# Altium schematic sheet AIM2 - External Interfaces REVB.SchDoc: External Interfaces
size B; DrawnBy: DJW; DocumentNumber: 7; SheetNumber: 7; SheetTotal: 12
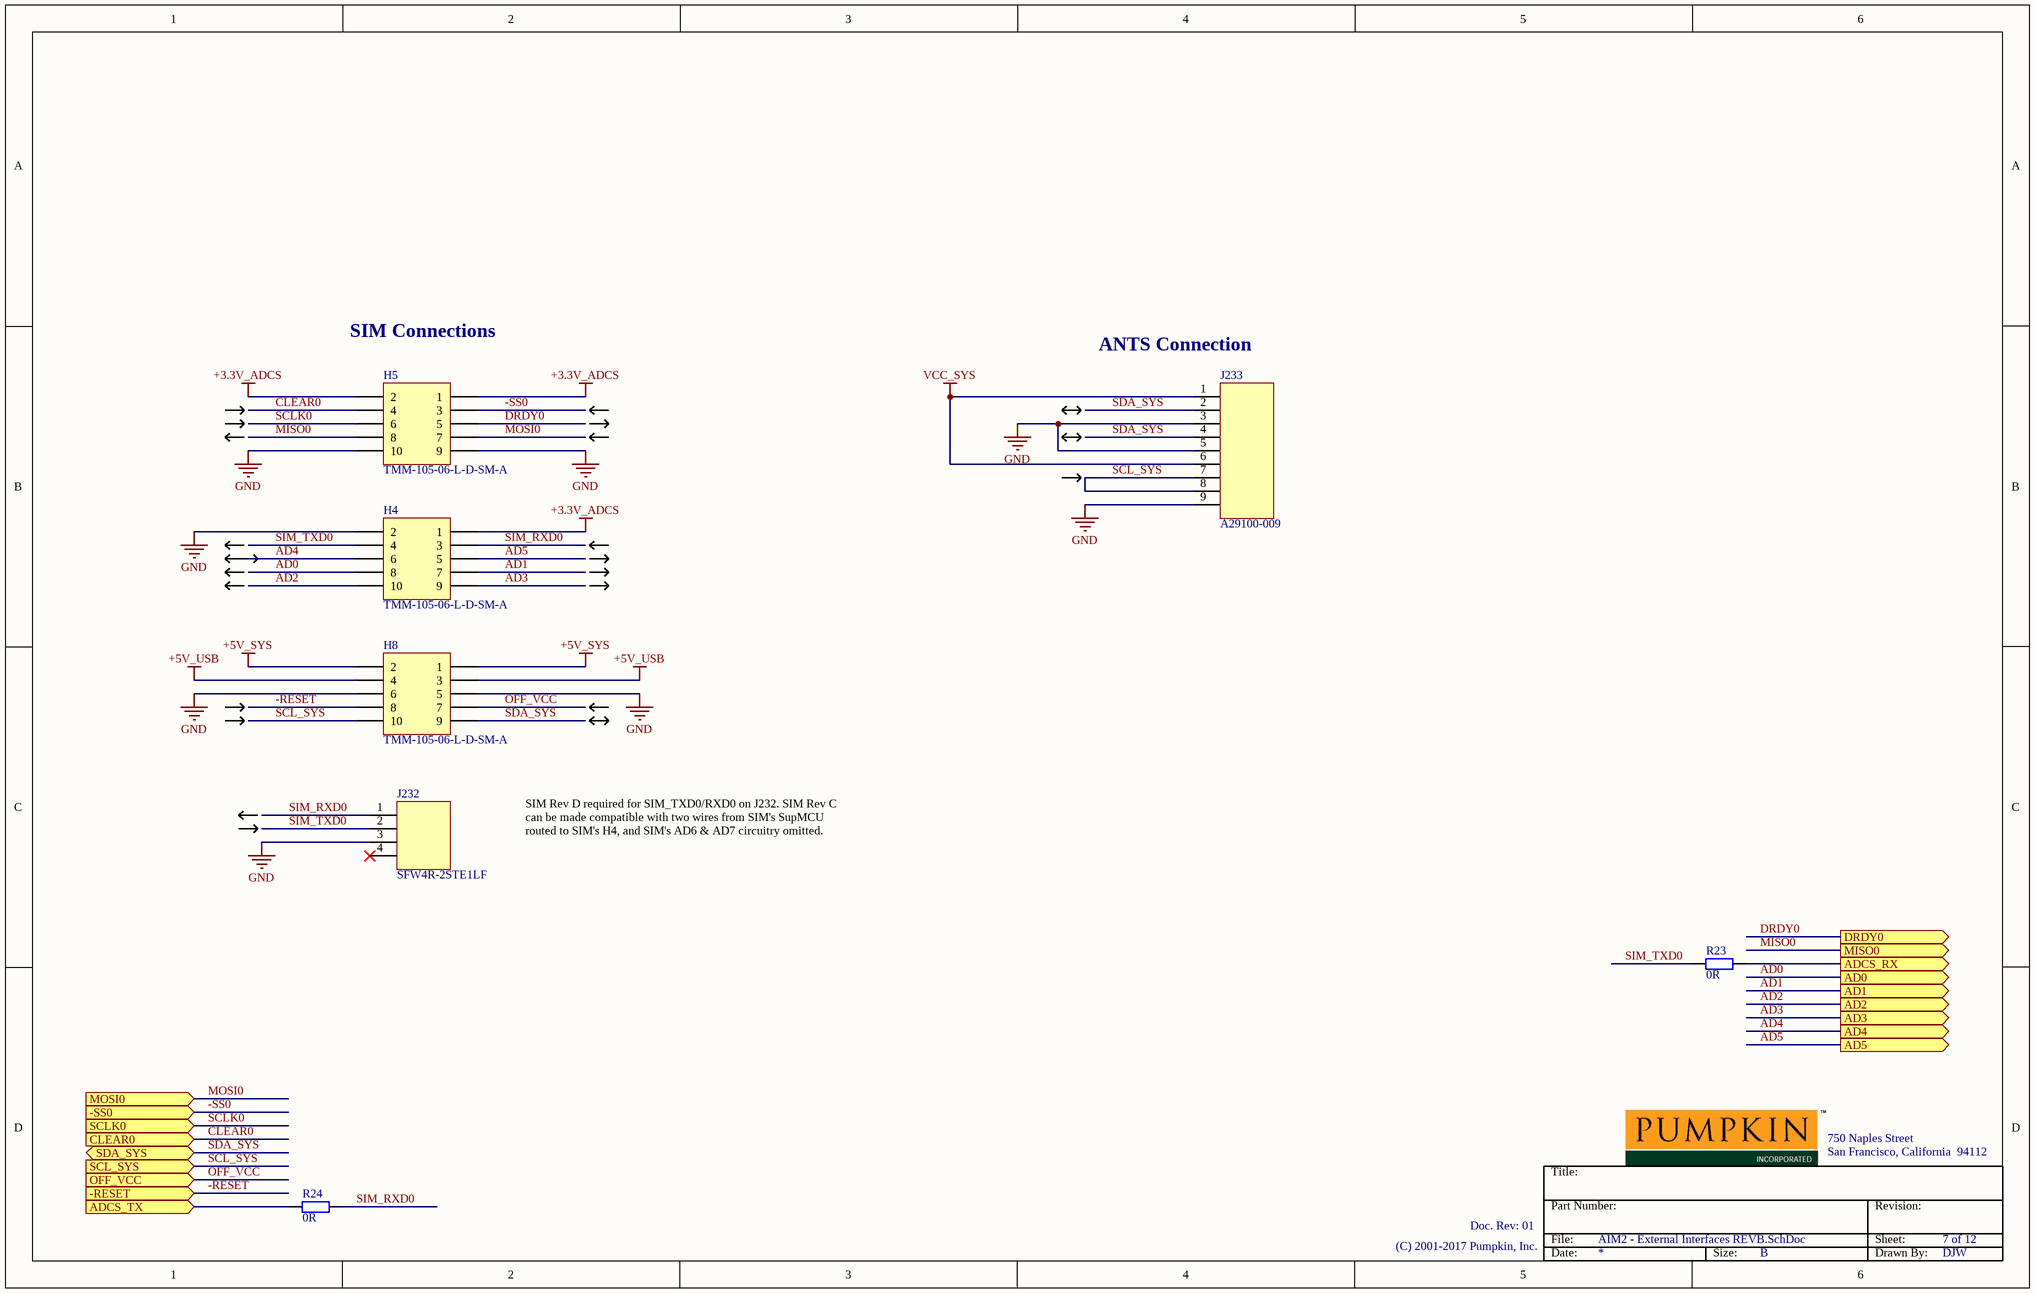
[diagram p0: AIM2 - External Interfaces REVB.SchDoc]

## Parts
H4  TMM-105-06-L-D-SM-A  [TMM-105-06-G-D-SM]
H5  TMM-105-06-L-D-SM-A  [TMM-105-06-G-D-SM]
H8  TMM-105-06-L-D-SM-A  [TMM-105-06-G-D-SM]
J232  SFW4R-2STE1LF  [SFW4R-2STE1LF]
J233  A29100-009  [A29100-009]
R23  0R  [0805 RES]
R24  0R  [0805 RES]

## Ports
-RESET (in), -SS0 (in), AD0 (out), AD1 (out), AD2 (out), AD3 (out), AD4 (out), AD5 (out), ADCS_RX (out), ADCS_TX (in), CLEAR0 (in), DRDY0 (out), MISO0 (out), MOSI0 (in), OFF_VCC (in), SCL_SYS (in), SCLK0 (in), SDA_SYS (bidir)

## Nets
+3.3V_ADCS: H4.1 H5.1 H5.2
+5V_SYS: H8.1 H8.2
+5V_USB: H8.3 H8.4
GND: H4.2 H5.9 H5.10 H8.5 H8.6 J232.3 J232.F J233.3 J233.5 J233.9 J233.F
VCC_SYS: J233.1 J233.6
-RESET: H8.8 ; port -RESET
-SS0: H5.3 ; port -SS0
AD0: H4.8 ; port AD0
AD1: H4.7 ; port AD1
AD2: H4.10 ; port AD2
AD3: H4.9 ; port AD3
AD4: H4.6 ; port AD4
AD5: H4.5 ; port AD5
ADCS_RX: R23.2 ; port ADCS_RX
ADCS_TX: R24.1 ; port ADCS_TX
CLEAR0: H5.4 ; port CLEAR0
DRDY0: H5.5 ; port DRDY0
MISO0: H5.8 ; port MISO0
MOSI0: H5.7 ; port MOSI0
OFF_VCC: H8.7 ; port OFF_VCC
SCL_SYS: H8.10 J233.7 J233.8 ; port SCL_SYS
SCLK0: H5.6 ; port SCLK0
SDA_SYS: H8.9 J233.2 J233.4 ; port SDA_SYS
SIM_RXD0: H4.3 J232.1 R24.2
SIM_TXD0: H4.4 J232.2 R23.1

Not connected (* = marked no-connect by the designer): J232 4(1)*

## Notes on the sheet
- SIM Connections
- (near J233) ANTS Connection
- SIM Rev D required for SIM_TXD0/RXD0 on J232. SIM Rev C can be made compatible with two wires from SIM's SupMCU routed to SIM's H4, and SIM's AD6 & AD7 circuitry omitted.
- Title:
- 750 Naples Street
- San Francisco, California  94112
- Doc. Rev: 01
- File:
- Part Number:
- Revision:
- Sheet:
- (C) 2001-2017 Pumpkin, Inc.
- Date:
- Size:
- B
- Drawn By:

## Library data of the parts
H4 H5 H8 = 5x2 2mm Header: Header 5x2 TH 2mm pitch; Supplier 1: Digi-Key; Supplier Part Number 1: SAM12979-ND
J232 = SFW4R-2STE1LF: Header Flex Connector 4 pin, top side; Supplier 1: Digi-Key; Supplier Part Number 1: 609-1884-1-ND
J233 = A29100-009: Header Omnetics A29100-009; Manufacturer 1: Omnetics; Manufacturer Part Number 1: A29100-009
R23 R24 = Resistor 0R 0805: Resistor 0R 0805 0.125W; Revision: Altium ETH 11-03.2008; Value: 0R; Supplier 1: Digi-Key; Supplier Part Number 1: P0.0ACT-ND